# EAGLE schematic opamp (EAGLE 6.1)
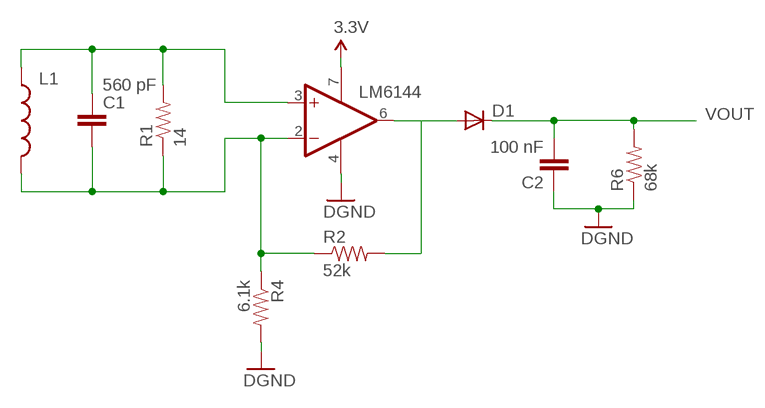
[diagram p0: schematic, sheet 1]

## Parts
C1  560 pF  CAP0603-CAP  [0603-CAP]
C2  100 nF  CAP0603-CAP  [0603-CAP]
D1  DIODE1N4148  [DIODE-1N4148]
L1  INDUCTOR-  [CDRH3D28]
LM6144  1AMP_P7+4N  [DIL08]
R1  14  RESISTOR0603-RES  [0603-RES]
R2  52k  RESISTOR0805-RES  [0805]
R4  6.1k  RESISTOR0805-RES  [0805]
R6  68k  RESISTOR0805-RES  [0805]

## Nets
3.3V: LM6144.7(V+)
GND: C2.1 LM6144.4(V-) R4.2 R6.1 ; supply symbol labelled DGND
N$1: C1.1 L1.1 LM6144.3(+IN) R1.2
N$2: C1.2 L1.2 LM6144.2(-IN) R1.1 R2.1 R4.1
N$3: D1.A LM6144.6(OUT) R2.2
VOUT: C2.2 D1.C R6.2

## Library data of the parts
C1 C2 = SparkFun-Passives:CAP: Capacitor Standard 0603 ceramic capacitor, and 0.1" leaded capacitor.
D1 = SparkFun-DiscreteSemi:DIODE: Diode These are standard reverse protection diodes and small signal diodes. SMA package can handle up to about 1A. SOD-323 can handle about 200mA. What the SOD-323 package when ordering, there are some mfgs out there that are 5-pin packages.
L1 = SparkFun-Passives:INDUCTOR: Inductors Basic Inductor/Choke - 0603 and 1206. Footprints are not proven and vary greatly between part numbers.
LM6144 = linear:1AMP_P7+4: OP AMP
R1 R2 R4 R6 = SparkFun-Passives:RESISTOR: Resistor Basic schematic elements and footprints for 0603, 1206, and PTH resistors.